# EAGLE design main2 (EAGLE 9.0.1)
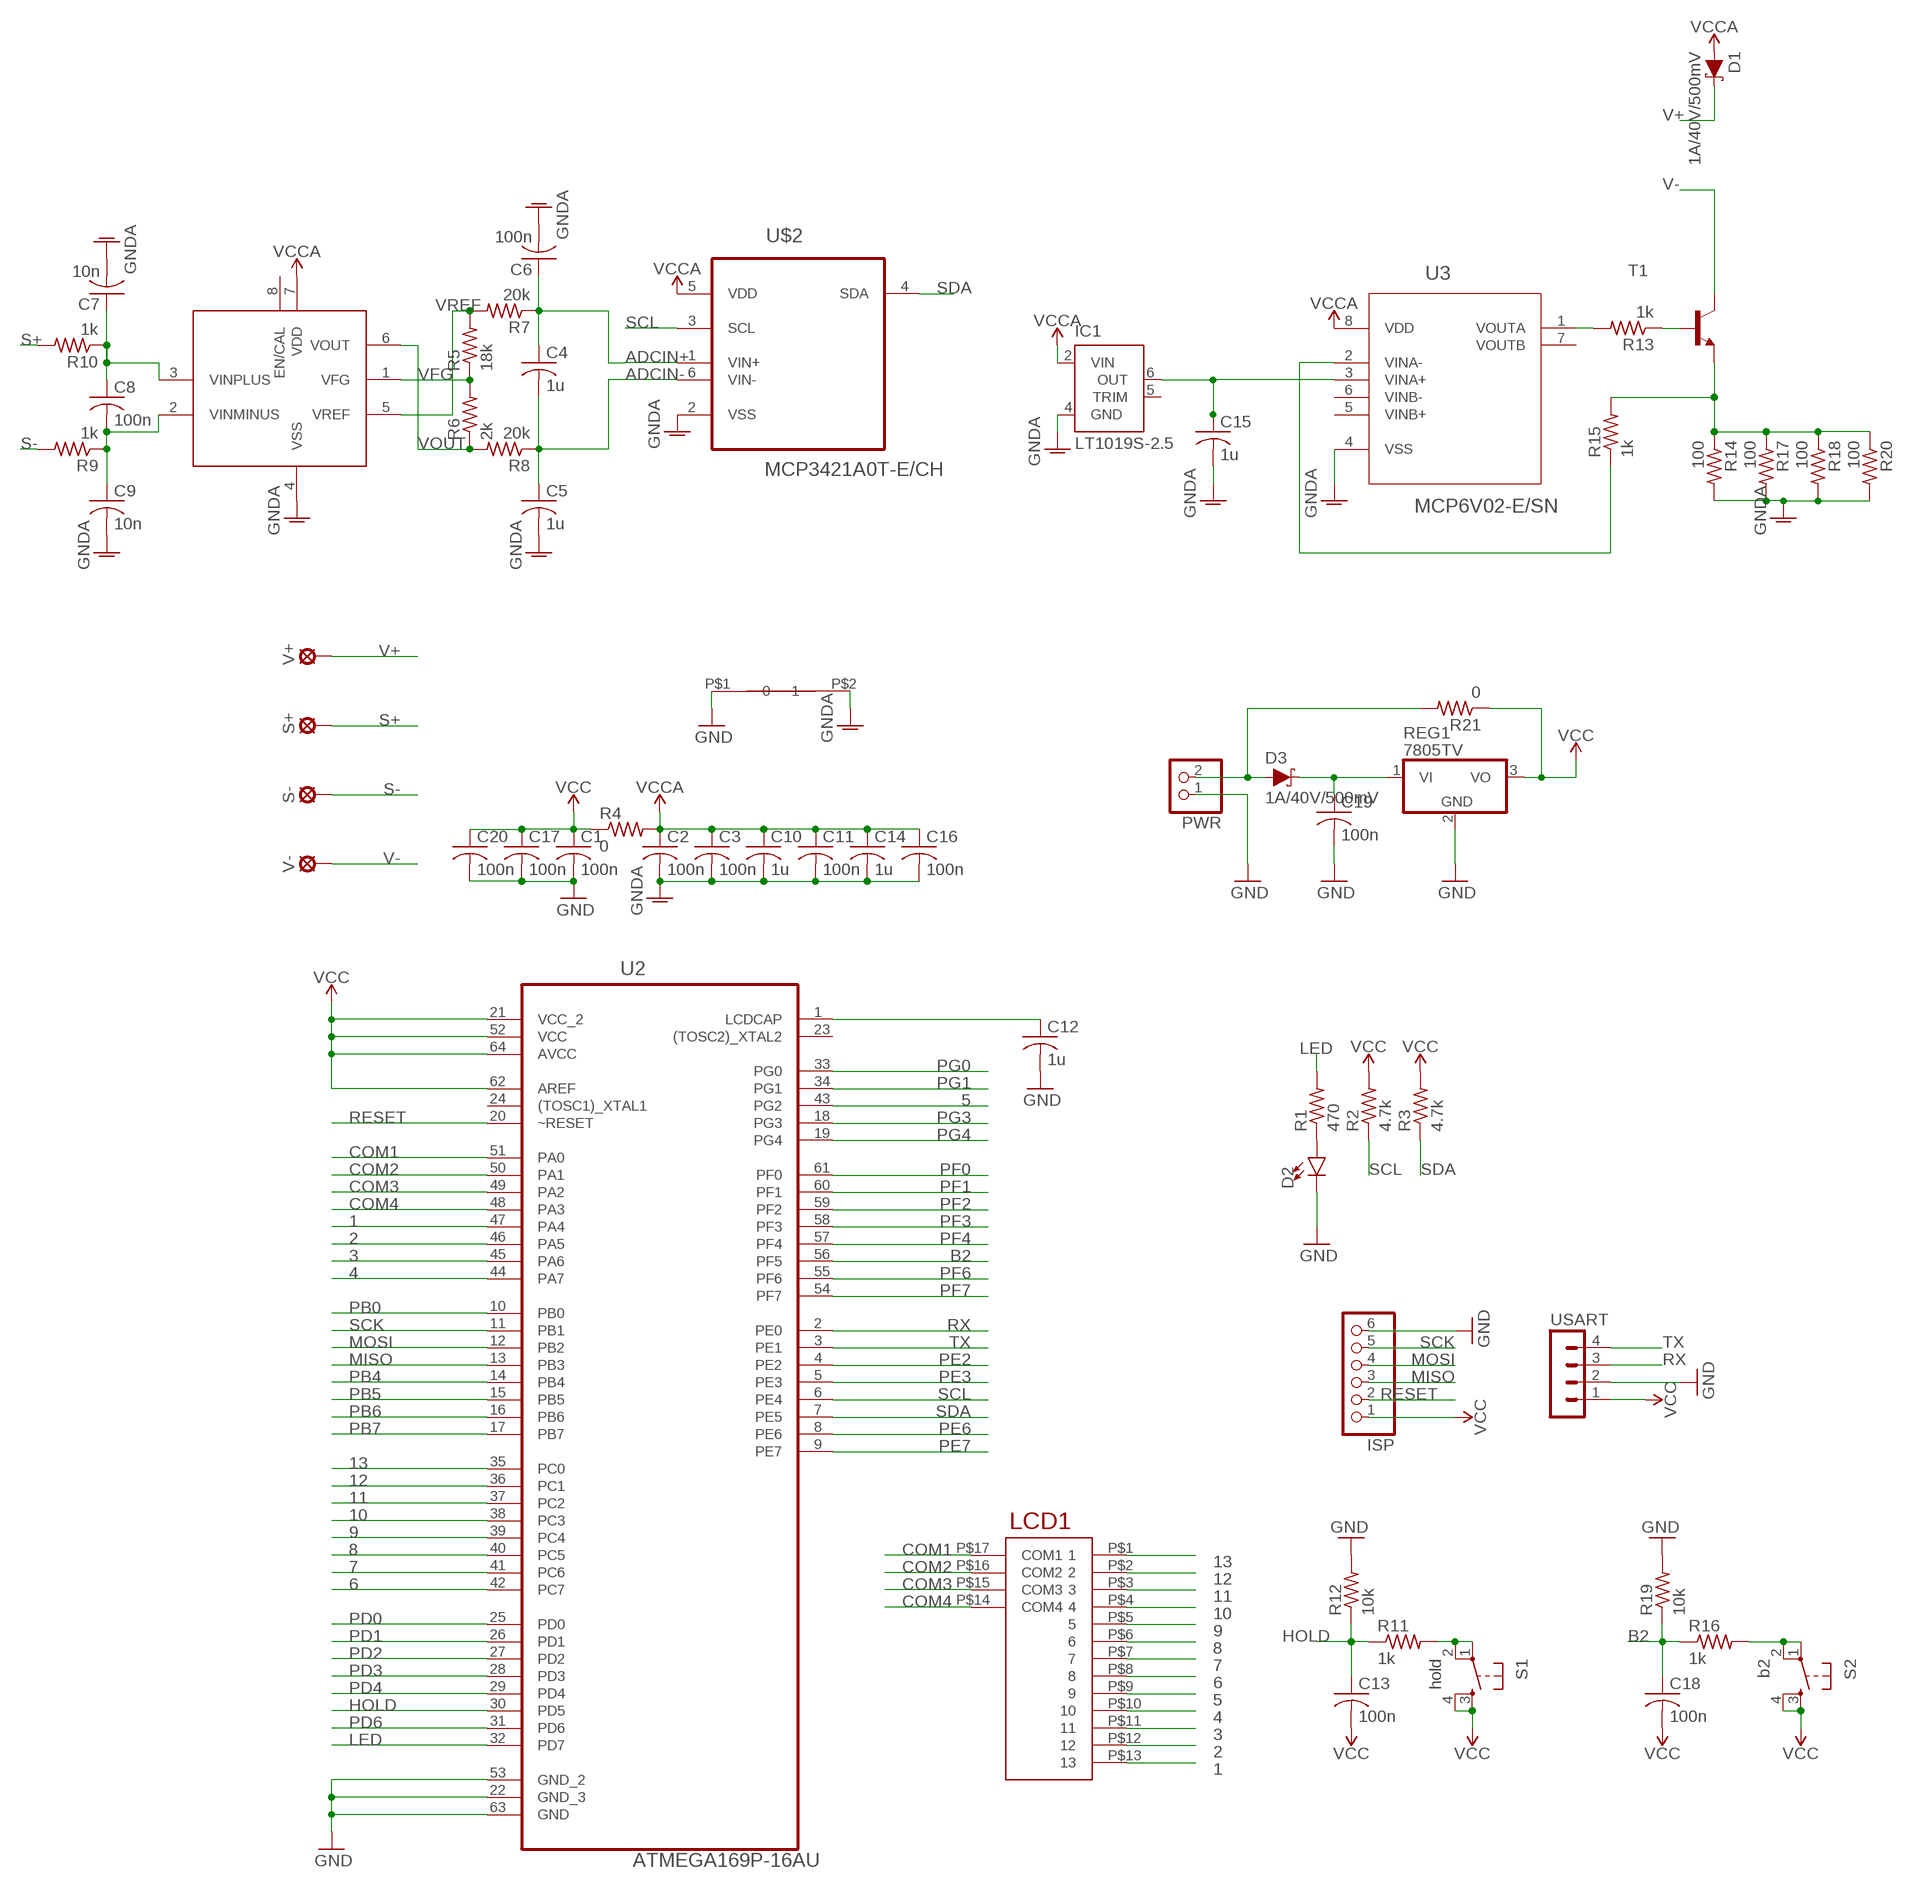
[diagram p0: schematic, sheet 1]

## Parts
C1  100n  C-USC0603  [C0603]
C2  100n  C-USC0603  [C0603]
C3  100n  C-USC0603  [C0603]
C4  1u  C-USC0603  [C0603]
C5  1u  C-USC0603  [C0603]
C6  100n  C-USC0603  [C0603]
C7  10n  C-USC0603  [C0603]
C8  100n  C-USC0603  [C0603]
C9  10n  C-USC0603  [C0603]
C10  1u  C-USC0603  [C0603]
C11  100n  C-USC0603  [C0603]
C12  1u  C-USC0603  [C0603]
C13  100n  C-USC0603  [C0603]
C14  1u  C-USC0603  [C0603]
C15  1u  C-USC0603  [C0603]
C16  100n  C-USC0603  [C0603]
C17  100n  C-USC0603  [C0603]
C18  100n  C-USC0603  [C0603]
C19  100n  C-USC0603  [C0603]
C20  100n  C-USC0603  [C0603]
D1  1A/40V/500mV  DIODE-SCHOTTKY-SS14  [SMA-DIODE]
D2  LED5MM  [LED_5MM]
D3  1A/40V/500mV  DIODE-SCHOTTKY-SS14  [SMA-DIODE]
IC1  LT1019S-2.5  [SOIC8]
ISP  PINHD-1X6  [1X06]
LCD1  GDC0570_LCD  [GDC0570_LCD]
PWR  PINHD-1X2  [1X02]
R1  470  R-US_R0603  [R0603]
R2  4.7k  R-US_R0603  [R0603]
R3  4.7k  R-US_R0603  [R0603]
R4  0  R-US_0309/12  [0309/12]
R5  18k  R-US_R0603  [R0603]
R6  2k  R-US_R0603  [R0603]
R7  20k  R-US_R0603  [R0603]
R8  20k  R-US_R0603  [R0603]
R9  1k  R-US_R0603  [R0603]
R10  1k  R-US_R0603  [R0603]
R11  1k  R-US_R0603  [R0603]
R12  10k  R-US_R0603  [R0603]
R13  1k  R-US_R0603  [R0603]
R14  100  R-US_R0603  [R0603]
R15  1k  R-US_R0603  [R0603]
R16  1k  R-US_R0603  [R0603]
R17  100  R-US_R0603  [R0603]
R18  100  R-US_R0603  [R0603]
R19  10k  R-US_R0603  [R0603]
R20  100  R-US_R0603  [R0603]
R21  0  R-US_R0603  [R0603]
REG1  7805TV  [TO220V]
S1  hold  TAC_SWITCHPTH  [TACTILE-PTH]
S2  b2  TAC_SWITCHPTH  [TACTILE-PTH]
S+  MCS08  [MCS08]
S-  MCS08  [MCS08]
T1  MMBT3904LT1-NPN-SOT23-BEC  [SOT23-BEC]
U2  ATMEGA169P-16AU  [QFP80P1600X1600X120-64N]
U3  MCP6V02-E/SN  [SOIC127P600X175-8N]
U$2  MCP3421A0T-E/CH  [SOT95P270X145-6N]
U$3  MCP6N11  [SOIC8]
U$10  SHORT32  [SHORT_32]
USART  MA04-1  [MA04-1]
V+  MCS08  [MCS08]
V-  MCS08  [MCS08]

## Nets
1: LCD1.P$13 U2.47(PA4)
2: LCD1.P$12 U2.46(PA5)
3: LCD1.P$11 U2.45(PA6)
4: LCD1.P$10 U2.44(PA7)
5: LCD1.P$9 U2.43(PG2)
6: LCD1.P$8 U2.42(PC7)
7: LCD1.P$7 U2.41(PC6)
8: LCD1.P$6 U2.40(PC5)
9: LCD1.P$5 U2.39(PC4)
10: LCD1.P$4 U2.38(PC3)
11: LCD1.P$3 U2.37(PC2)
12: LCD1.P$2 U2.36(PC1)
13: LCD1.P$1 U2.35(PC0)
ADCIN+: C4.1 C6.1 R7.1 U$2.1(VIN+)
ADCIN-: C4.2 C5.1 R8.1 U$2.6(VIN-)
B2: C18.1 R16.1 R19.1 U2.56(PF5)
COM1: LCD1.P$17(COM1) U2.51(PA0)
COM2: LCD1.P$16(COM2) U2.50(PA1)
COM3: LCD1.P$15(COM3) U2.49(PA2)
COM4: LCD1.P$14(COM4) U2.48(PA3)
GND: C1.2 C12.2 C17.2 C19.2 C20.2 D2.K(C) ISP.6 PWR.1 R12.2 R19.2 REG1.2(GND) U2.22(GND_3) U2.53(GND_2) U2.63(GND) U$10.P$1 USART.2
GNDA: C2.2 C3.2 C5.2 C6.2 C7.2 C9.2 C10.2 C11.2 C14.2 C15.2 C16.2 IC1.4(GND) R14.2 R17.2 R18.2 R20.2 U3.4(VSS) U$2.2(VSS) U$3.4(VSS) U$10.P$2
HOLD: C13.1 R11.1 R12.1 U2.30(PD5)
LCDCAP: C12.1 U2.1(LCDCAP)
LED: R1.2 U2.32(PD7)
MISO: ISP.3 U2.13(PB3)
MOSI: ISP.4 U2.12(PB2)
N2: R16.2 S2.1 S2.2
N$1: D3.A PWR.2 R21.2
N$2: C15.1 IC1.6(OUT) U3.3(VINA+)
N$3: R14.1 R15.2 R17.1 R18.1 R20.1 T1.E
N$4: C8.2 C9.1 R9.1 U$3.2(VINMINUS)
N$5: C7.1 C8.1 R10.1 U$3.3(VINPLUS)
N$6: D2.A R1.1
N$7: R13.2 U3.1(VOUTA)
N$8: R13.1 T1.B
N$9: R15.1 U3.2(VINA-)
N$10: R11.2 S1.1 S1.2
N$11: C19.1 D3.C REG1.1(VI)
PB0: U2.10(PB0)
PB4: U2.14(PB4)
PB5: U2.15(PB5)
PB6: U2.16(PB6)
PB7: U2.17(PB7)
PD0: U2.25(PD0)
PD1: U2.26(PD1)
PD2: U2.27(PD2)
PD3: U2.28(PD3)
PD4: U2.29(PD4)
PD6: U2.31(PD6)
PE2: U2.4(PE2)
PE3: U2.5(PE3)
PE6: U2.8(PE6)
PE7: U2.9(PE7)
PF0: U2.61(PF0)
PF1: U2.60(PF1)
PF2: U2.59(PF2)
PF3: U2.58(PF3)
PF4: U2.57(PF4)
PF6: U2.55(PF6)
PF7: U2.54(PF7)
PG0: U2.33(PG0)
PG1: U2.34(PG1)
PG3: U2.18(PG3)
PG4: U2.19(PG4)
RESET: ISP.2 U2.20(~RESET)
RX: U2.2(PE0) USART.3
S+: R10.2 S+.MP
S-: R9.2 S-.MP
SCK: ISP.5 U2.11(PB1)
SCL: R2.1 U2.6(PE4) U$2.3(SCL)
SDA: R3.1 U2.7(PE5) U$2.4(SDA)
TX: U2.3(PE1) USART.4
V+: D1.C V+.MP
V-: T1.C V-.MP
VCC: C1.1 C13.2 C17.1 C18.2 C20.1 ISP.1 R2.2 R3.2 R4.1 R21.1 REG1.3(VO) S1.3 S1.4 S2.3 S2.4 U2.21(VCC_2) U2.52(VCC) U2.62(AREF) U2.64(AVCC) USART.1
VCCA: C2.1 C3.1 C10.1 C11.1 C14.1 C16.1 D1.A IC1.2(VIN) R4.2 U3.8(VDD) U$2.5(VDD) U$3.7(VDD)
VFG: R5.1 R6.2 U$3.1(VFG)
VOUT: R6.1 R8.2 U$3.6(VOUT)
VREF: R5.2 R7.2 U$3.5(VREF)
Unconnected: IC1.5(TRIM) U2.23((TOSC2)_XTAL2) U2.24((TOSC1)_XTAL1) U3.5(VINB+) U3.6(VINB-) U3.7(VOUTB) U$3.8(EN/CAL)

## Library data of the parts
C1-C20 = rcl:C-US: CAPACITOR, American symbol; SPICEPREFIX: C
D1 D3 = SparkFun-DiscreteSemi:DIODE-SCHOTTKY: Schottky diode A Schottky diode is a semiconductor diode which has a low forward voltage drop and a very fast switching action.; PROD_ID: DIO-08053
D2 = SparkFun-LED:LED: LED (Generic) Standard schematic elements and footprints for 5mm, 3mm, 1206, and 0603 sized LEDs. Generic LEDs with no color specified.
IC1 = linear-technology:LT1019?*: Precision Voltage Reference Source: http://www.linear.com/pc/downloadDocument.do?navId=H0,C1,C1154,C1002,C1243,P1130,D3834; MPN: LT1019CS8-2.5#PBF; OC_FARNELL: 9559426; OC_NEWARK: 57M0929
ISP = pinhead:PINHD-1X6: PIN HEADER
LCD1 = 7_segment_lib:GDC0570_LCD
PWR = pinhead:PINHD-1X2: PIN HEADER
R1-R21 = rcl:R-US_: RESISTOR, American symbol; SPICEPREFIX: R
REG1 = linear:78*: Positive VOLTAGE REGULATOR Source: http://cache.national.com/ds/LM/LM78L05.pdf http://www.fairchildsemi.com/ds/LM/LM7805.pdf
S1 S2 = SparkFun-Retired:TAC_SWITCH: Momentary Switch Button commonly used for reset or general input. Spark Fun Electronics SKU : COM-00097 SMT- SWCH-08247
S+ S- V+ V- = solpad:MCS08: SOLDER PAD MC S0,8, drill 1.2 mm, distributor Buerklin, 08F130
T1 = DC_LOAD_AU:*-NPN-: NPN Transistror BF959 corrected 2008.03.06
U2 = 7_segment_lib:ATMEGA169P-16AU: 8-bit Microcontroller with 16K Bytes In-System Programmable Flash; MPN: ATMEGA169P-16AU; OC_FARNELL: 1675975; OC_NEWARK: 33P6478; PACKAGE: TQFP-64; SUPPLIER: Atmel
U3 = Microchip_By_element14_Batch_1:MCP6V02-E/SN: Auto-Zeroed Op Amps; MPN: MCP6V02-E/SN; OC_FARNELL: 1629346; OC_NEWARK: 27M0220; PACKAGE: SOIC-8; SUPPLIER: Microchip
U$2 = Microchip_By_element14_Batch_1:MCP3421A0T-E/CH: Analog-to-Digital Converter; MPN: MCP3421A0T-E/CH; OC_FARNELL: 1605567; OC_NEWARK: 77M2561; PACKAGE: SOT-6; SUPPLIER: Microchip
U$3 = 7_segment_lib:MCP6N11
U$10 = 7_segment_lib:SHORT
USART = con-lstb:MA04-1: PIN HEADER; OC_FARNELL: unknown; OC_NEWARK: unknown

## Board
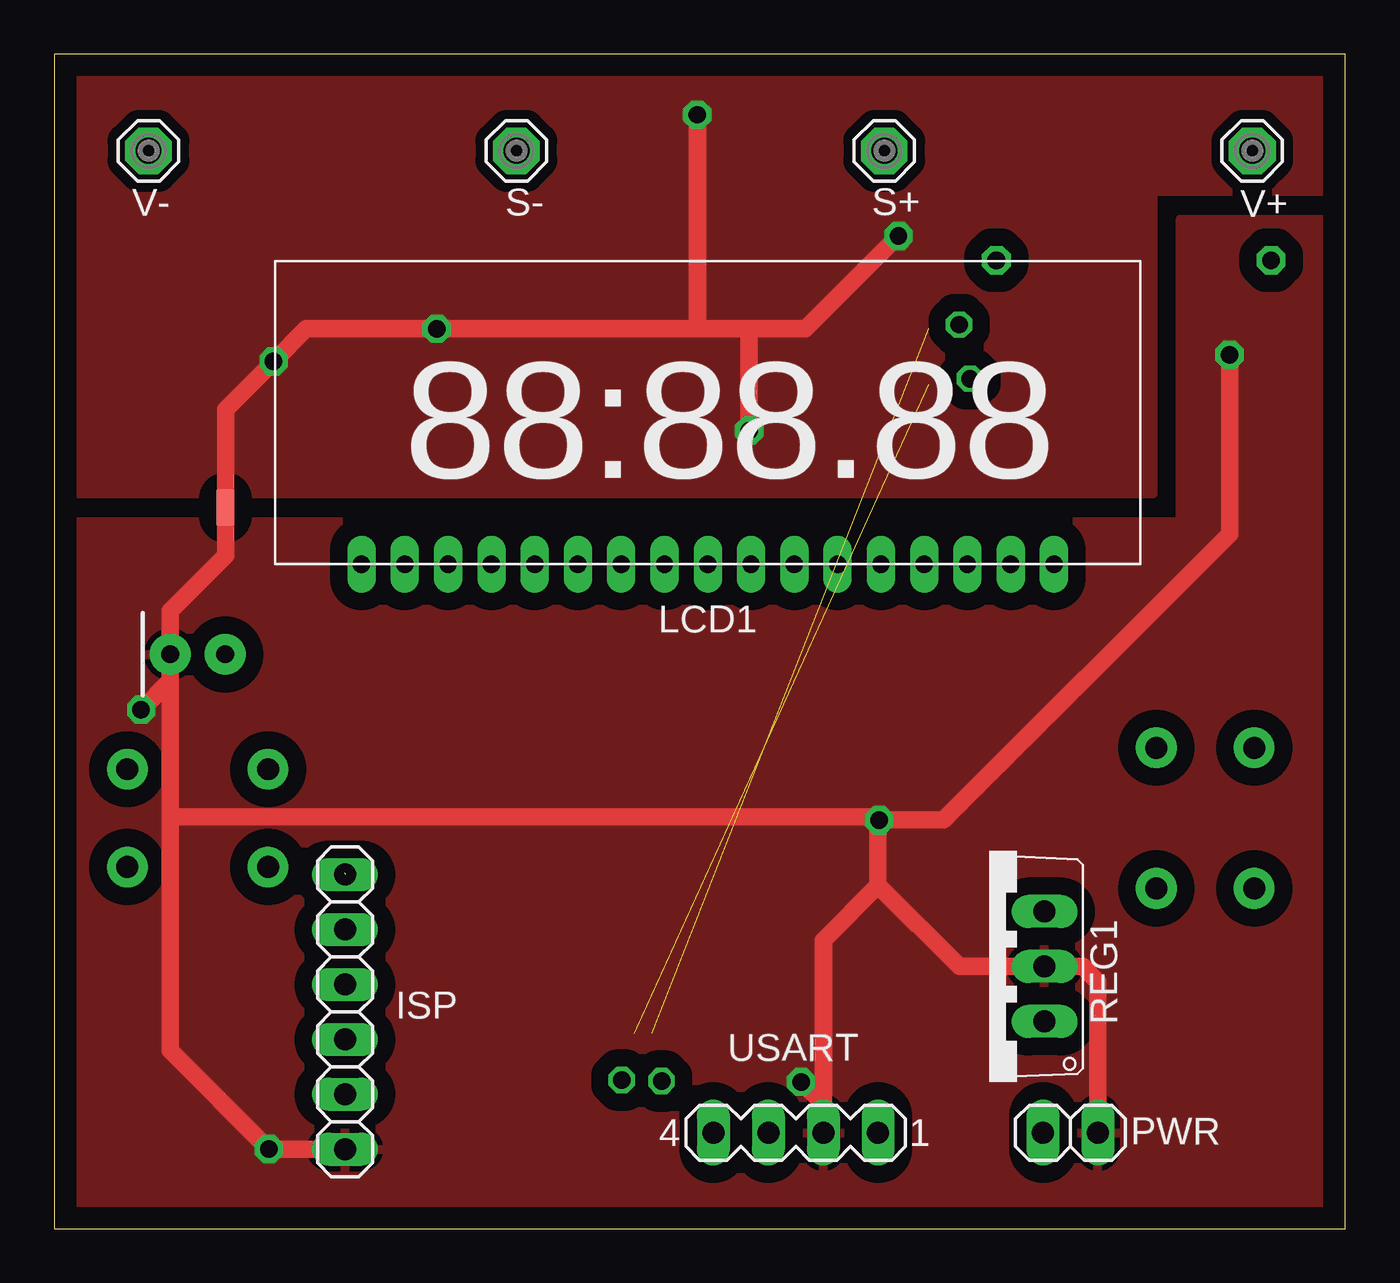
[diagram p1: board, top side]
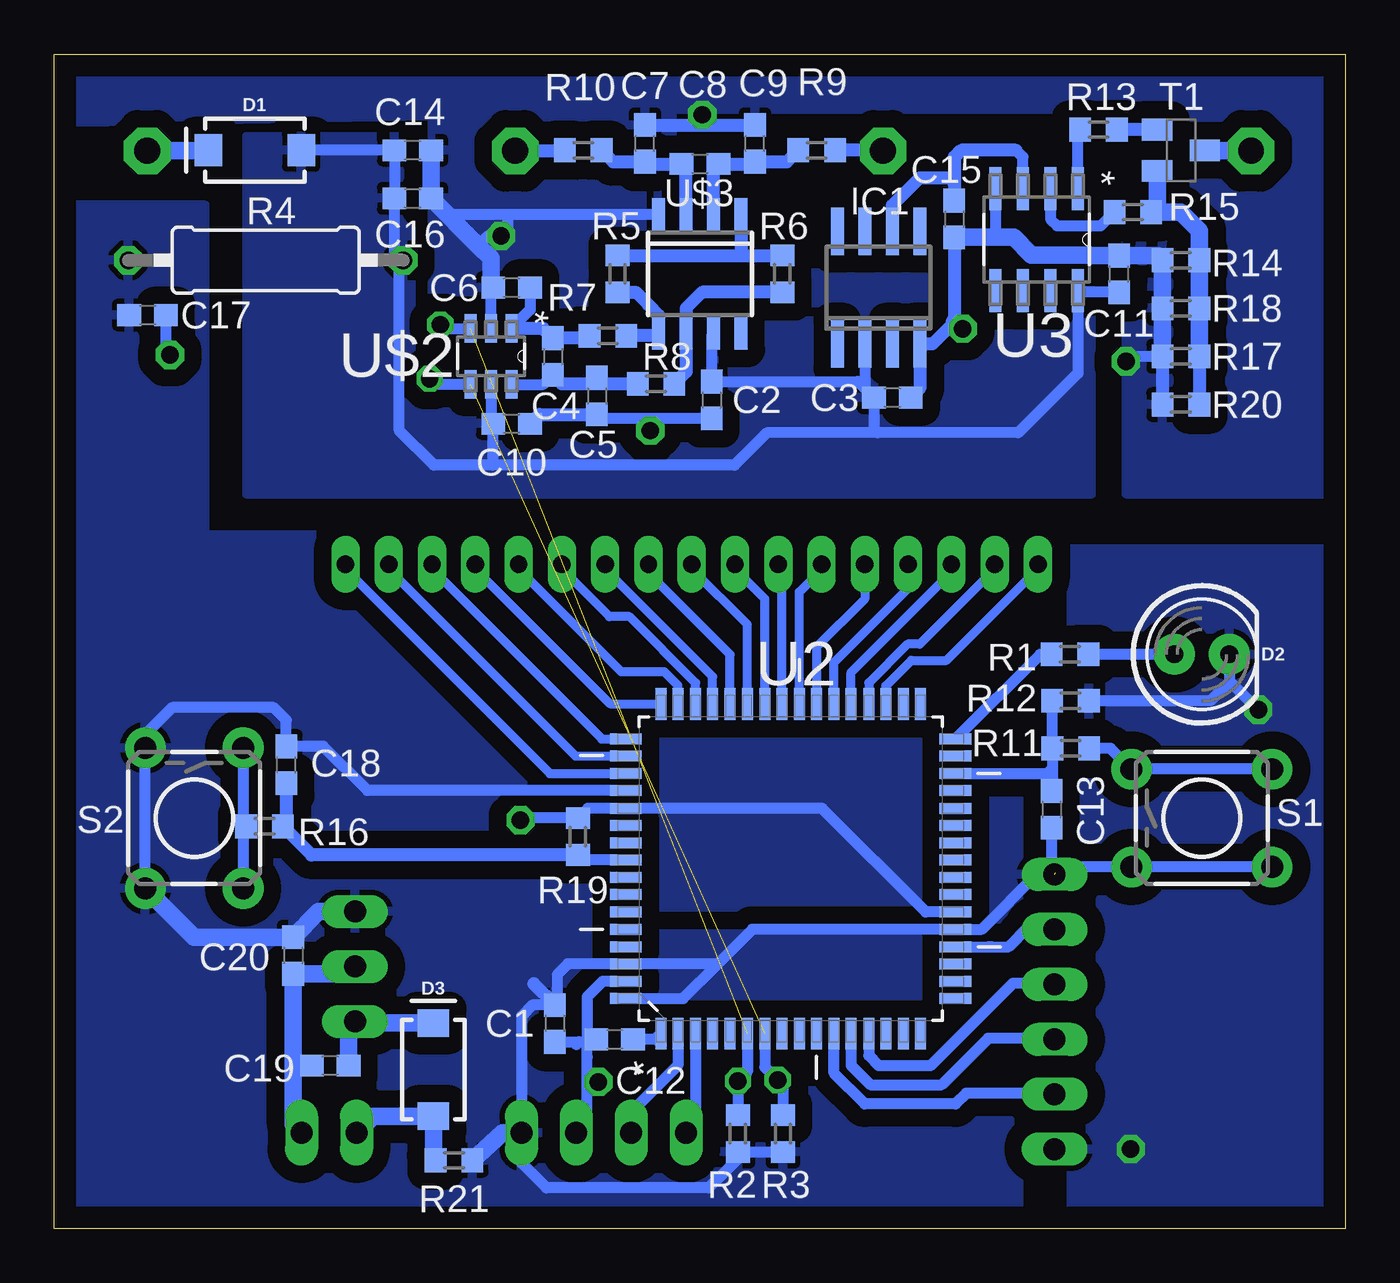
[diagram p2: board, bottom side, seen from below]

Size 59.67 x 54.28 mm. Coordinates in mm from the lower left corner, seen from the top.
Outline: 59.67,54.28 0,54.28 0,0 59.67,0 59.67,54.28
Copper layers (1*16): Top 0.035mm / dielectric 1.5mm / Bottom 0.035mm
Design rules "default *": minimum track width 16mil, minimum drill 0.6mm, track to track 10mil, track to pad 10mil, pad to pad 10mil, via to via 10mil, smd to smd 10mil, copper to edge 40mil, drill to drill 6mil, minimum pad ring 10mil, minimum via ring 8mil, stop-mask expansion 4mil, vias tented up to drill 0mil, thermal gap 10mil

### Footprints (pad centres in the part's own frame; a part is rotated, then mirrored left to right if it is on the bottom)
C0603 = smd 1.1 x 1: 1 -0.85,0; 2 0.85,0
SMA-DIODE = smd 1.27 x 1.47: A -2.15,0; C 2.15,0
LED_5MM = drill 0.813 pad 1.88: A -1.27,0; K 1.27,0
SOIC8 = smd 0.6 x 2.2: 1 -1.905,-2.6; 2 -0.635,-2.6; 3 0.635,-2.6; 4 1.905,-2.6; 5 1.905,2.6; 6 0.635,2.6; 7 -0.635,2.6; 8 -1.905,2.6
1X06 = drill 1.016 long: 1 -6.35,0; 2 -3.81,0; 3 -1.27,0; 4 1.27,0; 5 3.81,0; 6 6.35,0
GDC0570_LCD = drill 0.8 long: P$1 -16,0; P$2 -14,0; P$3 -12,0; P$4 -10,0; P$5 -8,0; P$6 -6,0; P$7 -4,0; P$8 -2,0; P$9 0,0; P$10 2,0; P$11 4,0; P$12 6,0; P$13 8,0; P$14 10,0; P$15 12,0; P$16 14,0; P$17 16,0
1X02 = drill 1.016 long: 1 -1.27,0; 2 1.27,0
R0603 = smd 1 x 1.1: 1 -0.85,0; 2 0.85,0
0309/12 = drill 0.813 octagon: 1 -6.35,0; 2 6.35,0
TO220V = drill 1.016 long: 1 -2.54,-2.54; 2 0,-2.54; 3 2.54,-2.54
TACTILE-PTH = drill 1.016 pad 1.88: 1 -3.251,2.261; 2 3.251,2.261; 3 -3.251,-2.261; 4 3.251,-2.261
MCS08 = drill 1.194 pad 2.159 octagon: MP 0,0
SOT23-BEC = smd 1 x 1.4: B -0.95,-1.1; C 0,1.1; E 0.95,-1.1
QFP80P1600X1600X120-64N = smd 1.473 x 0.508: 1 -7.62,5.994; 2 -7.62,5.207; 3 -7.62,4.394; 4 -7.62,3.607; 5 -7.62,2.794; 6 -7.62,2.007; 7 -7.62,1.194; 8 -7.62,0.406; 9 -7.62,-0.406; 10 -7.62,-1.194; 11 -7.62,-2.007; 12 -7.62,-2.794; 13 -7.62,-3.607; 14 -7.62,-4.394; 15 -7.62,-5.207; 16 -7.62,-5.994; 33 7.62,-5.994; 34 7.62,-5.207; 35 7.62,-4.394; 36 7.62,-3.607; 37 7.62,-2.794; 38 7.62,-2.007; 39 7.62,-1.194; 40 7.62,-0.406; 41 7.62,0.406; 42 7.62,1.194; 43 7.62,2.007; 44 7.62,2.794; 45 7.62,3.607; 46 7.62,4.394; 47 7.62,5.207; 48 7.62,5.994 | smd 0.508 x 1.473: 17 -5.994,-7.62; 18 -5.207,-7.62; 19 -4.394,-7.62; 20 -3.607,-7.62; 21 -2.794,-7.62; 22 -2.007,-7.62; 23 -1.194,-7.62; 24 -0.406,-7.62; 25 0.406,-7.62; 26 1.194,-7.62; 27 2.007,-7.62; 28 2.794,-7.62; 29 3.607,-7.62; 30 4.394,-7.62; 31 5.207,-7.62; 32 5.994,-7.62; 49 5.994,7.62; 50 5.207,7.62; 51 4.394,7.62; 52 3.607,7.62; 53 2.794,7.62; 54 2.007,7.62; 55 1.194,7.62; 56 0.406,7.62; 57 -0.406,7.62; 58 -1.194,7.62; 59 -2.007,7.62; 60 -2.794,7.62; 61 -3.607,7.62; 62 -4.394,7.62; 63 -5.207,7.62; 64 -5.994,7.62
SOIC127P600X175-8N = smd 1.981 x 0.559: 1 -2.362,1.905; 2 -2.362,0.635; 3 -2.362,-0.635; 4 -2.362,-1.905; 5 2.362,-1.905; 6 2.362,-0.635; 7 2.362,0.635; 8 2.362,1.905
SOT95P270X145-6N = smd 1.321 x 0.559: 1 -1.295,0.94; 2 -1.295,0; 3 -1.295,-0.94; 4 1.295,-0.94; 5 1.295,0; 6 1.295,0.94
SOIC8' = smd 0.6 x 1.5: 1 -1.905,-2.75; 2 -0.635,-2.75; 3 0.635,-2.75; 4 1.905,-2.75; 5 1.905,2.75; 6 0.635,2.75; 7 -0.635,2.75; 8 -1.905,2.75
SHORT_32 = smd 0.813 x 0.813: P$1 -0.406,0; P$2 0.406,0
MA04-1 = drill 1.016 long: 1 -3.81,0; 2 -1.27,0; 3 1.27,0; 4 3.81,0

### Placement (x,y rotation side)
C1  36.53,9.49 270 bottom
C2  29.29,38.3 270 bottom
C3  20.93,38.4 0 bottom
C4  36.62,40.31 270 bottom
C5  34.59,38.48 270 bottom
C6  38.52,43.48 180 bottom
C7  32.36,50.15 90 bottom
C8  29.82,49.2 0 bottom
C9  27.29,50.15 90 bottom
C10  38.52,37.2 0 bottom
C11  10.46,44.12 90 bottom
C12  33.76,8.75 180 bottom
C13  13.58,19.38 270 bottom
C14  43.1,49.83 0 bottom
C15  18.08,46.66 270 bottom
C16  43.1,47.61 0 bottom
C17  55.35,42.21 0 bottom
C18  48.94,21.44 90 bottom
C19  46.91,7.54 180 bottom
C20  48.62,12.62 270 bottom
D1  50.4,49.83 180 bottom
D2  6.63,26.54 0 bottom
D3  42.14,7.35 90 bottom
IC1  21.57,43.48 0 bottom
ISP  13.44,10.02 270 top
LCD1  30.21,30.71 0 top
PWR  46.97,4.43 180 top
R1  12.73,26.54 180 bottom
R2  28.07,4.39 270 bottom
R3  25.99,4.39 270 bottom
R4  49.89,44.75 0 bottom
R5  33.63,44.12 270 bottom
R6  26.02,44.12 90 bottom
R7  34.08,41.26 0 bottom
R8  31.86,39.04 0 bottom
R9  24.43,49.83 0 bottom
R10  35.22,49.83 180 bottom
R11  12.69,22.2 0 bottom
R12  12.71,24.4 0 bottom
R13  11.41,50.79 180 bottom
R14  7.6,44.75 180 bottom
R15  9.82,46.98 0 bottom
R16  49.94,18.59 180 bottom
R17  7.6,40.31 180 bottom
R18  7.6,42.53 180 bottom
R19  35.46,18.12 90 bottom
R20  7.6,38.09 180 bottom
R21  41.19,3.16 180 bottom
REG1  43.22,12.12 90 top
S1  6.63,18.97 0 bottom
S2  53.19,18.97 270 bottom
S+  38.36,49.81 270 top
S-  21.36,49.81 270 top
T1  7.6,49.83 270 bottom
U2  25.63,16.64 90 bottom
U3  14.27,45.71 270 bottom
U$2  39.48,40.31 270 bottom
U$3  MCP6N11  [SOIC8']  29.82,44.12 180 bottom
U$10  7.92,33.32 90 top
USART  34.27,4.43 180 top
V+  55.36,49.81 270 top
V-  4.36,49.81 270 top

### Tracks (layer width: path | path; a pad name or v marks a point on that pad's centre or on a via)
1
  Bottom 0.406: U2.47 30.84,25.11 31.47,25.74 33.46,25.74 38.21,30.48 LCD1.P$13
2
  Bottom 0.406: U2.46 30.03,25.23 33.08,28.28 34.01,28.28 36.21,30.48 LCD1.P$12
3
  Bottom 0.406: U2.45 29.24,25.52 34.21,30.48 LCD1.P$11
4
  Bottom 0.406: U2.44 28.43,26.53 32.21,30.3 LCD1.P$10
5
  Bottom 0.406: U2.43 27.64,27.92 30.21,30.48 LCD1.P$9
6
  Bottom 0.406: U2.42 26.83,29.11 28.21,30.48 LCD1.P$8
7
  Bottom 0.406: U2.41 26.04,30.54 LCD1.P$7
8
  Bottom 0.406: U2.40 25.23,29.43 23.95,30.71 LCD1.P$6
9
  Bottom 0.406: LCD1.P$5 22.21,29.11 24.44,26.87 U2.39
10
  Bottom 0.406: U2.38 23.63,26.17 20.21,29.59 LCD1.P$4
11
  Bottom 0.406: U2.37 22.84,25.7 18.21,30.34 LCD1.P$3
12
  Bottom 0.406: LCD1.P$2 16.21,30.48 19.67,27.02 20.24,27.02 22.03,25.23 U2.36
13
  Bottom 0.406: U2.35 21.24,25.08 20.06,26.26 18.43,26.26 14.21,30.48 LCD1.P$1
ADCIN+
  Bottom 0.508: C6.1 37.67,42.47 U$2.1
  Bottom 0.61: R7.1 35.03,41.16 C4.1 37.06,41.61 U$2.1
ADCIN-
  Bottom 0.508: 38.51,39.04 U$2.6 37.06,39.01 C4.2
  Bottom 0.61: R8.1 34.59,39.04 | 34.59,39.04 36.2,39.04 C4.2 | C5.1 34.59,39.04
B2
  Bottom 0.508: U2.56 35.23,17.04 R19.1
  Bottom 0.61: C18.1 48.94,18.75 R16.1 47.77,17.27 R19.1
COM1
  Bottom 0.406: LCD1.P$17 46.21,30.48 36.75,21.03 U2.51
COM2
  Bottom 0.406: LCD1.P$16 44.21,30.48 35.57,21.84 U2.50
COM3
  Bottom 0.406: LCD1.P$15 42.21,30.48 34.35,22.63 U2.49
COM4
  Bottom 0.406: LCD1.P$14 40.21,30.48 33.98,24.26 U2.48
GND  (via drill 0.8 pad 1.3)
  Top 0.813: U$10.P$1 7.92,31.1 5.37,28.55 D2.K 5.37,25.32 | v54.32,40.38 54.32,32.1 41.1,18.88 v38.12,18.88 | 38.08,15.86 41.83,12.12 REG1.2 47.54,12.12 48.24,11.42 PWR.1 | 38.08,15.86 38.08,18.84 v38.12,18.88 | v34.52,6.78 35.54,5.76 USART.2 35.54,13.32 38.08,15.86 | 13.37,3.68 v9.92,3.68 5.37,8.24 5.37,19.04 | v4.02,23.98 5.37,25.32 | 5.37,25.32 5.37,19.04 | v38.12,18.88 37.96,19.04 5.37,19.04
  Bottom 0.508: D2.K 5.37,25.27 | R12.2 10.14,24.4 6.24,24.4 5.37,25.27 | C1.2 35.41,8.64 | 35.41,8.64 35.03,8.64 | 35.03,8.64 34.72,8.64 C12.2 | 35.54,8.51 35.41,8.64 | U2.63 34.32,11.43 35.03,10.72 35.03,8.64 | v4.02,23.98 5.31,25.27 5.37,25.27 | v34.52,6.78 35.03,7.29 35.03,7.93 | 35.03,7.93 35.03,8.64 | v38.12,18.88 38.03,18.97 R19.2 35.01,19.43 U2.53 24.19,19.43 19.39,14.63 U2.22 | C17.2 54.5,40.56 v54.32,40.38 | USART.2 35.03,4.94 35.03,7.93
  Bottom 0.813: REG1.2 46.11,11.77 C20.2 48.62,7.61 | PWR.1 48.62,4.81 48.62,7.61 | C19.2 48.56,7.54 48.62,7.61
  pour Bottom (isolate 0.813): 12.68,-0.33 -0.02,-0.33 -0.02,31.42 12.68,31.42
  pour Top (isolate 0.813): 59.67,46.66 59.67,-0.33 -0.02,-0.33 -0.02,32.69 52.05,32.69 52.05,46.66
  pour Bottom (isolate 0.813): 19.03,23.16 32.05,23.16 32.05,14.91 19.03,14.91
GNDA  (via drill 0.8 pad 1.3)
  Top 0.813: U$10.P$2 7.92,37.86 v10.14,40.08 11.64,41.59 v17.68,41.59 27.41,41.59 29.82,41.59 | v39.02,45.88 34.73,41.59 32.05,41.59 | 32.05,41.59 29.82,41.59 | v29.72,51.48 29.72,41.69 29.82,41.59 | v32.12,36.88 32.12,41.52 32.05,41.59
  Bottom 0.508: C6.2 39.48,43.38 U$2.2 | U$3.4 38.72,46.87 | 38.72,46.87 41.5,46.87 C16.2 | U3.4 16.17,45.81 | 30.02,51 29.72,51.3 v29.72,51.48 | 40.07,45.43 39.62,45.88 v39.02,45.88 38.72,46.18 38.72,46.87 | R17.2 9.59,40.31 v10.14,40.08 | C5.2 34.4,37.45 32.02,37.45 | 32.02,37.45 C2.2 | 32.02,37.45 32.12,37.35 v32.12,36.88
  Bottom 0.61: C7.2 30.02,51 C9.2 | C10.2 37.24,37.63 C5.2 | C15.2 18.08,41.9 19.09,40.89 IC1.4 19.66,38.82 C3.2 | R17.2 R20.2
  Bottom 0.813: R17.2 R18.2 R14.2 8.67,44.97 C11.2 11.78,44.97 11.81,45 14.51,45 15.32,45.81 16.17,45.81 C15.2 | C14.2 C16.2 40.07,45.43 39.48,44.84 39.48,43.38 | 18.08,41.9 17.99,41.9 v17.68,41.59
  pour Top (isolate 0.813): 59.67,54.28 59.67,47.93 50.78,47.93 50.78,33.96 -0.02,33.96 -0.02,54.28
  pour Bottom (isolate 0.813): 59.67,54.28 59.67,51.1 42.21,51.42 42.21,42.53 31.09,42.53 31.09,51.74 10.14,51.74 10.14,33.96 -0.02,33.96 -0.02,54.28
HOLD
  Bottom 0.508: R12.1 13.55,22.21 R11.1 13.54,21.26 | 13.54,21.26 13.54,20.27 C13.1 | U2.30 13.77,21.03 13.54,21.26
LCDCAP
  Bottom 0.508: U2.1 31.89,8.75 C12.1
LED
  Bottom 0.508: U2.32 14.1,26.54 R1.2
MISO
  Bottom 0.508: U2.13 22.03,8 21.57,7.54 19.16,7.54 15.36,11.34 13.49,11.34 ISP.3
MOSI
  Bottom 0.508: U2.12 22.84,7.54 21.95,6.66 18.65,6.66 16.5,8.8 13.49,8.8 ISP.4
N2
  Bottom 0.508: S2.1 50.93,18.59 | 50.93,18.59 S2.2 | R16.2 50.93,18.59
N$1
  Bottom 0.813: PWR.2 44.93,5.2 D3.A 42.14,3.39 R21.2
N$2
  Bottom 0.508: U3.3 14.9,49.52 15.22,49.83
  Bottom 0.61: 15.22,49.83 17.76,49.83 18.08,49.52 18.08,48.57 | 18.08,48.57 18.08,48.25 C15.1 | IC1.6 20.93,47.29 19.66,48.57 18.08,48.57
N$3
  Bottom 0.61: R17.1 R20.1
  Bottom 0.813: R17.1 R18.1 R14.1 6.75,46.13 7.6,46.98 R15.2 8.7,47.25 T1.E
N$4
  Bottom 0.61: U$3.2 29.19,48.99 C8.2 27.07,49.2 C9.1 25.81,49.3 R9.1
N$5
  Bottom 0.61: U$3.3 30.46,48.99 C8.1 32.26,49.2 C7.1 33.84,49.3 R10.1
N$6
  Bottom 0.508: D2.A R1.1
N$7
  Bottom 0.508: U3.1 12.36,50.68 R13.2
N$8
  Bottom 0.61: T1.B R13.1
N$9
  Bottom 0.508: U3.2 13.63,46.66 13.32,46.34 11.31,46.34 R15.1
N$10
  Bottom 0.508: S1.2 S1.1 10.85,22.2 R11.2
N$11
  Bottom 0.813: D3.C 45.69,9.5 | 45.69,9.5 REG1.1 | C19.1 46.06,9.14 45.69,9.5
RESET
  Bottom 0.508: U2.20 16.49,13.03 | 16.49,13.03 16.34,13.03 | 16.49,13.03 15.56,13.03 14.69,13.89 13.51,13.89 ISP.2
RX
  Bottom 0.508: U2.2 30.84,7.54 33,5.38 USART.3
S+
  Bottom 0.61: S+.MP 36.1,49.81 R10.2
S-
  Bottom 0.61: S-.MP 21.39,49.83 R9.2
SCK
  Bottom 0.508: U2.11 23.63,7.19 22.21,5.77 18.01,5.77 17.52,6.26 13.49,6.26 ISP.5
SCL  (via drill 0.8)  (1 unrouted)
  Bottom 0.508: U2.6 27.64,7.25 v28.07,6.82 R2.1 | v41.82,41.78 41.64,41.61 U$2.3
SDA  (via drill 0.8)  (1 unrouted)
  Bottom 0.508: U2.7 26.83,7.47 v26.23,6.87 25.99,6.63 R3.1 | U$2.4 42.05,39.01 v42.32,39.28
TX
  Bottom 0.508: U2.3 30.03,4.86 USART.4
V+
  Bottom 0.813: V+.MP 52.57,49.81 D1.C
V-
  Bottom 0.813: V-.MP 6.48,49.81 T1.C
VCC  (1 unrouted)
  Bottom 0.508: 29,12.24 U2.62 35.92,12.24 36.43,11.74 36.43,10.44 C1.1 37.56,10.34 38.08,9.82 USART.1 38.08,3.04 36.92,1.88 29.42,1.88 28.82,2.48 28.07,3.23 R2.2 R3.2 | 29,12.24 27.4,13.84 U2.21 16.8,13.84 14.2,16.43 13.42,16.43 | U2.64 30.6,10.64 29,12.24 | S1.4 S1.3 13.14,16.71 13.42,16.43 | C13.2 13.58,16.59 13.42,16.43 | U2.52 45.18,20.24 47.23,22.29 C18.2 48.94,23.5 49.52,24.08 54.22,24.08 55.45,22.85 S2.3 S2.4
  Bottom 0.61: 37.51,11.32 C1.1
  Bottom 0.813: REG1.3 47.44,14.66 C20.1 53.2,13.47 S2.4 | R21.1 38.95,4.43 USART.1
  pour Bottom (isolate 0.813, rank 2): 59.67,-0.08 15.09,-0.08 15.09,32.18 52.68,32.05 52.68,47.29 59.67,47.29
VCCA
  Bottom 0.508: U$3.7 29.29,41.27 C2.1 22.53,39.15 22.21,38.82 | IC1.2 22.21,38.82 | 22.21,38.82 C3.1 21.79,36.95 21.62,36.78 | C11.1 12.29,43.27 U3.8 12.36,39.54 15.12,36.78 21.62,36.78 | 21.62,36.78 26.72,36.78 28.22,35.28 39.42,35.28 | 39.42,35.28 42.12,35.28 43.72,36.88 43.72,44.58 R4.2 43.95,45.16 C16.1 C14.1 D1.A | U$2.5 39.48,37.3 C10.1 39.42,37.15 39.42,35.28
  pour Bottom (isolate 0.813): 50.78,33.96 11.73,33.96 11.73,50.47 30.14,50.15 30.14,41.58 43.16,41.58 43.16,50.47 50.78,50.47
VFG
  Bottom 0.61: R5.1 27.92,44.97 | 27.92,44.97 R6.2 | U$3.1 27.92,44.97
VOUT
  Bottom 0.61: R6.1 29.72,43.27 30.46,42.53 U$3.6 30.46,39.59 R8.2
VREF
  Bottom 0.61: R5.2 32.78,43.27 32.21,42.69 31.73,42.21 U$3.5 31.84,41.26 R7.2